# Altium schematic sheet SSD.SchDoc
size A4; SheetNumber: 6
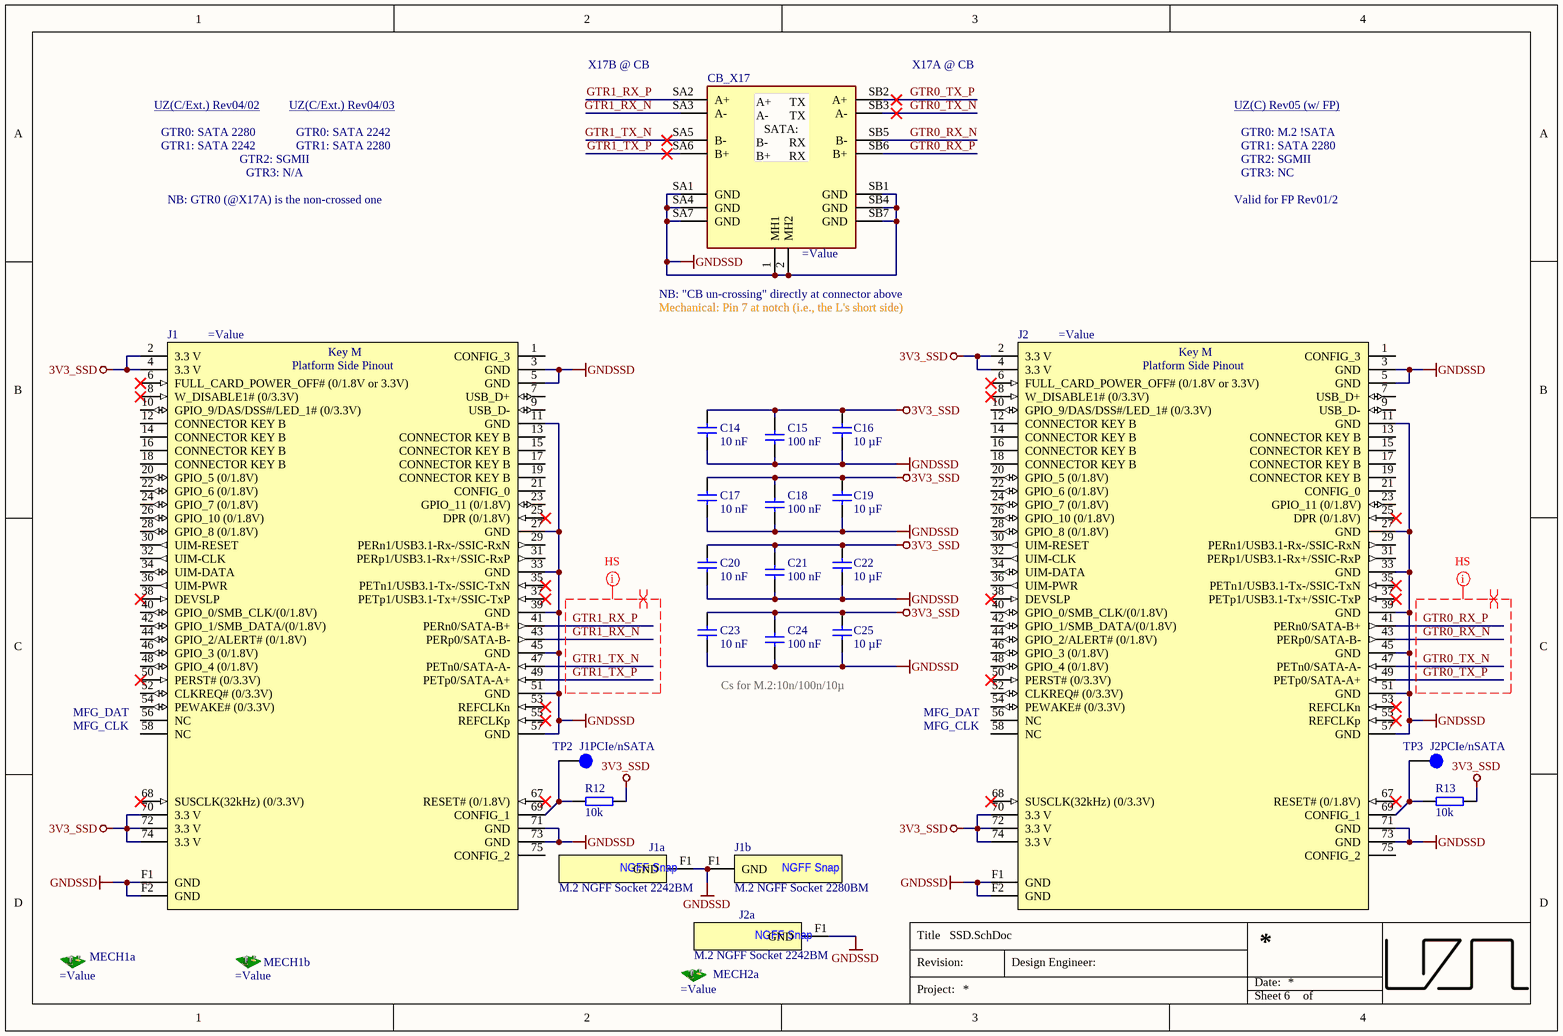
[diagram p0: SSD.SchDoc]

## Parts
C14  10 nF  [C_0603_TE]
C15  100 nF  [C_0603_TE]
C16  10 µF  [C_1206_TE]
C17  10 nF  [C_0603_TE]
C18  100 nF  [C_0603_TE]
C19  10 µF  [C_1206_TE]
C20  10 nF  [C_0603_TE]
C21  100 nF  [C_0603_TE]
C22  10 µF  [C_1206_TE]
C23  10 nF  [C_0603_TE]
C24  100 nF  [C_0603_TE]
C25  10 µF  [C_1206_TE]
CB_X17  (no value)  [XUTS-0722-2070]
J1  (no value)  [M.2-M-Key]
J1a  M.2 NGFF Socket 2242BM  [M.2-NGFF-Socket-2242BM]  (no BOM)
J1b  M.2 NGFF Socket 2280BM  [M.2-NGFF-Socket-2280BM]  (no BOM)
J2  (no value)  [M.2-M-Key]
J2a  M.2 NGFF Socket 2242BM  [M.2-NGFF-Socket-2242BM]  (no BOM)
MECH1a  (no value)  [WA-SMSI-2.5mm]
MECH1b  (no value)  [WA-SMSI-2.5mm]
MECH2a  (no value)  [WA-SMSI-2.5mm]
R12  10k  [R_0603_TE]
R13  10k  [R_0603_TE]
TP2  J1PCIe/nSATA  [TP_1mm]  (no BOM)
TP3  J2PCIe/nSATA  [TP_1mm]  (no BOM)

## Nets
3V3_SSD: C14.1 C15.1 C16.2 C17.1 C18.1 C19.2 C20.1 C21.1 C22.2 C23.1 C24.1 C25.2 J1.2(3.3_V) J1.4(3.3_V) J1.70(3.3_V) J1.72(3.3_V) J1.74(3.3_V) J2.2(3.3_V) J2.4(3.3_V) J2.70(3.3_V) J2.72(3.3_V) J2.74(3.3_V) R12.1 R13.1
GNDSSD: C14.2 C15.2 C16.1 C17.2 C18.2 C19.1 C20.2 C21.2 C22.1 C23.2 C24.2 C25.1 CB_X17.1(MH1) CB_X17.2(MH2) CB_X17.SA1(GND) CB_X17.SA4(GND) CB_X17.SA7(GND) CB_X17.SB1(GND) CB_X17.SB4(GND) CB_X17.SB7(GND) J1.3(GND) J1.5(GND) J1.11(GND) J1.27(GND) J1.33(GND) J1.39(GND) J1.45(GND) J1.51(GND) J1.57(GND) J1.71(GND) J1.73(GND) J1.F1(GND) J1.F2(GND) J1a.F1(GND) J1b.F1(GND) J2.3(GND) J2.5(GND) J2.11(GND) J2.27(GND) J2.33(GND) J2.39(GND) J2.45(GND) J2.51(GND) J2.57(GND) J2.71(GND) J2.73(GND) J2.F1(GND) J2.F2(GND) J2a.F1(GND)
GTR0_RX_N: CB_X17.SB5(B-) J2.43(PERp0/SATA-B-)
GTR0_RX_P: CB_X17.SB6(B+) J2.41(PERn0/SATA-B+)
GTR0_TX_N: CB_X17.SB3(A-) J2.47(PETn0/SATA-A-)
GTR0_TX_P: CB_X17.SB2(A+) J2.49(PETp0/SATA-A+)
GTR1_RX_N: CB_X17.SA3(A-) J1.43(PERp0/SATA-B-)
GTR1_RX_P: CB_X17.SA2(A+) J1.41(PERn0/SATA-B+)
GTR1_TX_N: CB_X17.SA5(B-) J1.47(PETn0/SATA-A-)
GTR1_TX_P: CB_X17.SA6(B+) J1.49(PETp0/SATA-A+)
NetJ1_69: J1.69(CONFIG_1) R12.2 TP2.1
NetJ2_69: J2.69(CONFIG_1) R13.2 TP3.1

Not connected (* = marked no-connect by the designer): J1 1(CONFIG_3) 6(FULL_CARD_POWER_OFF#_(0/1.8V_or_3.3V))* 7(USB_D+) 8(W_DISABLE1#_(0/3.3V))* 9(USB_D-) 10(GPIO_9/DAS/DSS#/LED_1#_(0/3.3V)) 12(CONNECTOR_KEY_B) 13(CONNECTOR_KEY_B) 14(CONNECTOR_KEY_B) 15(CONNECTOR_KEY_B) 16(CONNECTOR_KEY_B) 17(CONNECTOR_KEY_B) 18(CONNECTOR_KEY_B) 19(CONNECTOR_KEY_B) 20(GPIO_5_(0/1.8V)) 21(CONFIG_0) 22(GPIO_6_(0/1.8V)) 23(GPIO_11_(0/1.8V)) 24(GPIO_7_(0/1.8V)) 25(DPR_(0/1.8V))* 26(GPIO_10_(0/1.8V)) 28(GPIO_8_(0/1.8V)) 29(PERn1/USB3.1-Rx-/SSIC-RxN) 30(UIM-RESET) 31(PERp1/USB3.1-Rx+/SSIC-RxP) 32(UIM-CLK) 34(UIM-DATA) 35(PETn1/USB3.1-Tx-/SSIC-TxN)* 36(UIM-PWR) 37(PETp1/USB3.1-Tx+/SSIC-TxP)* 38(DEVSLP)* 40(GPIO_0/SMB_CLK/(0/1.8V)) 42(GPIO_1/SMB_DATA/(0/1.8V)) 44(GPIO_2/ALERT#_(0/1.8V)) 46(GPIO_3_(0/1.8V)) 48(GPIO_4_(0/1.8V)) 50(PERST#_(0/3.3V))* 52(CLKREQ#_(0/3.3V)) 53(REFCLKn)* 54(PEWAKE#_(0/3.3V)) 55(REFCLKp)* 56(NC) 58(NC) 67(RESET#_(0/1.8V))* 68(SUSCLK(32kHz)_(0/3.3V))* 75(CONFIG_2); J2 1(CONFIG_3) 6(FULL_CARD_POWER_OFF#_(0/1.8V_or_3.3V))* 7(USB_D+) 8(W_DISABLE1#_(0/3.3V))* 9(USB_D-) 10(GPIO_9/DAS/DSS#/LED_1#_(0/3.3V)) 12(CONNECTOR_KEY_B) 13(CONNECTOR_KEY_B) 14(CONNECTOR_KEY_B) 15(CONNECTOR_KEY_B) 16(CONNECTOR_KEY_B) 17(CONNECTOR_KEY_B) 18(CONNECTOR_KEY_B) 19(CONNECTOR_KEY_B) 20(GPIO_5_(0/1.8V)) 21(CONFIG_0) 22(GPIO_6_(0/1.8V)) 23(GPIO_11_(0/1.8V)) 24(GPIO_7_(0/1.8V)) 25(DPR_(0/1.8V))* 26(GPIO_10_(0/1.8V)) 28(GPIO_8_(0/1.8V)) 29(PERn1/USB3.1-Rx-/SSIC-RxN) 30(UIM-RESET) 31(PERp1/USB3.1-Rx+/SSIC-RxP) 32(UIM-CLK) 34(UIM-DATA) 35(PETn1/USB3.1-Tx-/SSIC-TxN)* 36(UIM-PWR) 37(PETp1/USB3.1-Tx+/SSIC-TxP)* 38(DEVSLP)* 40(GPIO_0/SMB_CLK/(0/1.8V)) 42(GPIO_1/SMB_DATA/(0/1.8V)) 44(GPIO_2/ALERT#_(0/1.8V)) 46(GPIO_3_(0/1.8V)) 48(GPIO_4_(0/1.8V)) 50(PERST#_(0/3.3V))* 52(CLKREQ#_(0/3.3V)) 53(REFCLKn)* 54(PEWAKE#_(0/3.3V)) 55(REFCLKp)* 56(NC) 58(NC) 67(RESET#_(0/1.8V))* 68(SUSCLK(32kHz)_(0/3.3V))* 75(CONFIG_2)

## Layout directives
differential pair: GTR0_RX_N, GTR0_RX_P, GTR0_TX_N, GTR0_TX_P, GTR1_RX_N, GTR1_RX_P, GTR1_TX_N, GTR1_TX_P
net class HS: GTR0_RX_N, GTR0_RX_P, GTR0_TX_N, GTR0_TX_P, GTR1_RX_N, GTR1_RX_P, GTR1_TX_N, GTR1_TX_P

## Notes on the sheet
- UZ(C/Ext.) Rev04/02
- UZ(C/Ext.) Rev04/03
- X17B @ CB
- X17A @ CB
- UZ(C) Rev05 (w/ FP)
- GTR0: SATA 2280
- GTR1: SATA 2242
- GTR2: SGMII
- GTR3: N/A
- GTR0: SATA 2242
- GTR1: SATA 2280
- (near CB_X17) A+      TX
  A-       TX
  SATA:
  B-       RX
  B+      RX
- GTR0: M.2 !SATA
- GTR3: NC
- NB: GTR0 (@X17A) is the non-crossed one
- Valid for FP Rev01/2
- (near CB_X17) NB: "CB un-crossing" directly at connector above
- Mechanical: Pin 7 at notch (i.e., the L's short side)
- (near J1) MFG_DAT
- Cs for M.2:10n/100n/10µ
- (near J2) MFG_DAT
- (near J1) MFG_CLK
- (near J2) MFG_CLK
- Title
- Revision:
- Design Engineer:
- Date:
- Project:
- Sheet
- of
- (in symbol 1-2199230-5) Key M; Platform Side Pinout
- (in symbol M.2 NGFF Socket 2242BM) NGFF Snap
- (in symbol M.2 NGFF Socket 2280BM) NGFF Snap

## Library data of the parts
C14 C17 C20 C23 = UZgen_C_0603_10nF_50V_X7R: Generic capacitor; Manufacturer: UZgen; Voltage: 50V; Tolerance: 10 %; Created from: UZgenTool; Technology: X7R; Value: 10 nF; Manufacturer Part Number: UZgen_C_0603_10nF_50V_X7R; PartID: 4263; Created On: 02/08/2024 11:18:09; Device Package: 0603; Mounting Type: SMD; Last Updated: 02/08/2024 11:18:09
C15 C18 C21 C24 = UZgen_C_0603_100nF_50V_X7R: Generic capacitor; Manufacturer: UZgen; Tolerance: 10 %; Voltage: 50V; Created from: AGeiger; Technology: X7R; Value: 100 nF; Manufacturer Part Number: UZgen_C_0603_100nF_50V_X7R; PartID: 1; Created On: 02/07/2024 14:42:23; Device Package: 0603; Mounting Type: SMD; Last Updated: 08/08/2024 15:01:15
C16 C19 C22 C25 = UZgen_C_1206_10uF_50V_X7R: Generic capacitor; Manufacturer: UZgen; Tolerance: 10 %; Voltage: 50V; Created from: MGeier; Value: 10 µF; Manufacturer Part Number: UZgen_C_1206_10uF_50V_X7R; PartID: 5807; Created On: 20/03/2025 14:05:00; Device Package: 1206; Technology: X7R; Mounting Type: SMD; Last Updated: 20/03/2025 14:05:00
CB_X17 = XUTS-0722-2070: 1.27mm SATA Bend insert 14P -55℃~+105℃ Push-Pull,P=1.27mm Edgeboard Connectors ROHS; Manufacturer: Lian Xin Technology; Created from: FRosner; Manufacturer Part Number: XUTS-0722-2070; PartID: 44; Created On: 21/08/2024 13:19:35; ComponentLink1Description: Datasheet; ComponentLink1URL: https://wmsc.lcsc.com/wmsc/upload/file/pdf/v2/lcsc/2309271036_Lian-Xin-Technology-XUTS-0722-2070_C18202154.pdf; Last Updated: 10/09/2024 09:30:32; Mounting Type: THT; Operating Temperature: -55 °C to +85 °C; Supplier 1: LCSC; Supplier Part Number 1: C18202154; Value: XUTS-0722-2070; LCSC Part Number: C18202154
J1 J2 = 1-2199230-5: M.2 0.5mm Surface Mount 67 SMD,P=0.5mm Card Edge Connectors ROHS; Manufacturer: TE Connectivity; Created from: AGeiger; Manufacturer Part Number: 1-2199230-5; PartID: 12; Created On: 06/06/2023 08:54:40; ComponentLink1Description: Datasheet; ComponentLink1URL: https://www.mouser.de/datasheet/2/418/9/ENG_DS_1_1773702_1NGFFQRG_EN_0214_1_1773702_1NGFF_-3328389.pdf; Last Updated: 25/02/2025 09:18:43; Mounting Type: SMD; Operating Temperature: -40 °C to +80 °C; Series: M2; Supplier 1: LCSC; Supplier Part Number 1: C590854; Value: 1-2199230-5; LCSC Part Number: C590854
J1a J2a = M.2 NGFF Socket 2242BM: M.2 NGFF Socket 2242BM Snap; Manufacturer: n.a.; AN: 26334; Mixed: SMT; Extra: Variant of 25485; Created from: AGeiger; HelpURL: B:\AD\adlib\datasheet\1-2199119-0; Manufacturer Part Number: M.2 NGFF Socket 2242BM; PartID: 14; Created On: 06/06/2023 09:00:23; ComponentLink1Description: Datasheet; ComponentLink1URL: https://datasheet.lcsc.com/lcsc/2302021209_YIYUAN-SMTSOM325BTR_C5301784.pdf; Last Updated: 06/06/2023 09:04:37; Series: M2; Supplier 1: n.a.; Supplier Part Number 1: n.a.; Value: M.2 NGFF Socket 2242BM
J1b = M.2 NGFF Socket 2280BM: M.2 NGFF Socket 2280BM Snap; Manufacturer: n.a.; AN: 26274; Mixed: SMT; Extra: Variant of 25485; Created from: AGeiger; HelpURL: B:\AD\adlib\datasheet\1-2199119-0; Manufacturer Part Number: M.2 NGFF Socket 2280BM; PartID: 15; Created On: 06/06/2023 09:01:36; ComponentLink1Description: Datasheet; ComponentLink1URL: https://datasheet.lcsc.com/lcsc/2302021209_YIYUAN-SMTSOM325BTR_C5301784.pdf; Last Updated: 06/06/2023 09:04:37; Series: M2; Supplier 1: n.a.; Supplier Part Number 1: n.a.; Value: M.2 NGFF Socket 2280BM
MECH1a MECH1b MECH2a = SMTSOM325BTR: SMD Nut; Manufacturer: YIYUAN; AN: 32101; Mixed: THT; H-ART: 9774025360; Temperature-Range: -55/+150 (Abs); Extra: WA-SMSI; Created from: AGeiger; HelpURL: B:\AD\adlib\datasheet\WE_9774025360; LCSC Part #: C5301784; Manufacturer Part Number: SMTSOM325BTR; PartID: 13; Created On: 06/06/2023 08:57:00; ComponentLink1Description: Datasheet; ComponentLink1URL: https://datasheet.lcsc.com/lcsc/2302021209_YIYUAN-SMTSOM325BTR_C5301784.pdf; Last Updated: 06/06/2023 08:57:00; Mounting Type: SMD; Series: M2; Supplier 1: LCSC; Supplier Part Number 1: C5301784; Value: SMTSOM325BTR; LCSC Part Number: C5301784
R12 R13 = UZgen_R_0603_10k: Generic resistor; Manufacturer: UZgen; Tolerance: 1 %; Created from: AGeiger; Value: 10k; Manufacturer Part Number: UZgen_R_0603_10k; PartID: 1; Created On: 02/07/2024 14:34:53; Device Package: 0603; Mounting Type: SMD; Last Updated: 02/07/2024 14:37:16
TP2 TP3 = NULL: Testpoint 1mm; Manufacturer Part Number: NULL; Created from: AGeiger; Created: 2018_06_25_AGeiger; PartID: 9; Created On: 20/09/2022 13:14:57; Component Type: Testpoint; Last Updated: 20/09/2022 13:15:39; Manufacturer: NULL; Supplier 1: NULL; Supplier Part Number 1: NULL; Type: Testpoint; Live Cycle Status: 1
  TP2: Value: J1PCIe/nSATA
  TP3: Value: J2PCIe/nSATA